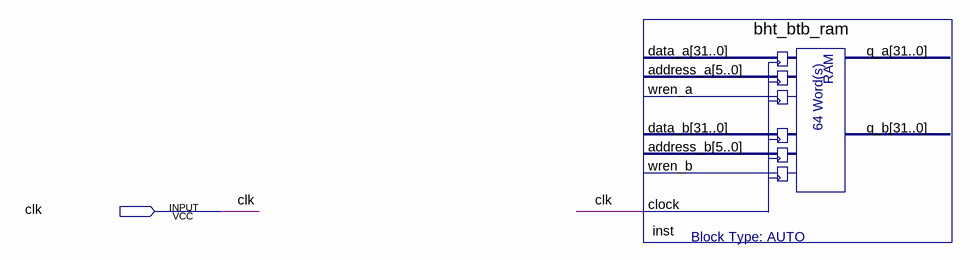
[diagram p0: schematic sheet]
// Quartus schematic bht_module.bdf as structural Verilog: 1 symbols, 1 pins
module bht_module (
  input  clk
);

  bht_btb_ram inst (.clock(clk));  // open: data_a, address_a, wren_a, data_b, address_b, wren_b, q_a, q_b
endmodule
